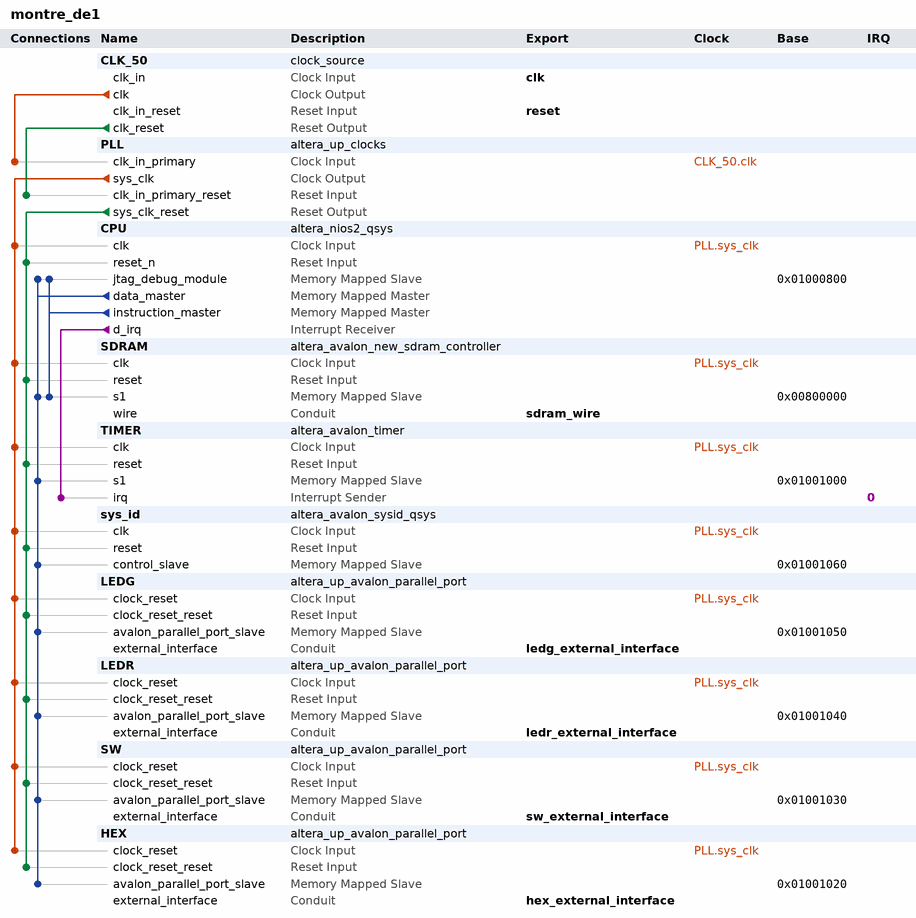
[diagram p0: system contents]
# Platform Designer (Qsys) system montre_de1, Cyclone II EP2C20F484C7
# Parameters at their usual value, and those the tool derives, are not listed.
package require -exact qsys 13.0
create_system montre_de1
set_project_property DEVICE_FAMILY {Cyclone II}
set_project_property DEVICE EP2C20F484C7

add_instance CLK_50 clock_source 13.0
set_instance_parameter_value CLK_50 clockFrequency 50000000

add_instance PLL altera_up_clocks 13.0
set_instance_parameter_value PLL board DE1
set_instance_parameter_value PLL vga_clk false
set_instance_parameter_value PLL audio_clk false
set_instance_parameter_value PLL audio_clk_freq 12.288

add_instance CPU altera_nios2_qsys 13.0
set_instance_parameter_value CPU resetSlave SDRAM.s1
set_instance_parameter_value CPU mmu_TLBMissExcSlave None
set_instance_parameter_value CPU exceptionSlave SDRAM.s1
set_instance_parameter_value CPU breakSlave CPU.jtag_debug_module
set_instance_parameter_value CPU impl Tiny
set_instance_parameter_value CPU icache_size 4096

add_instance SDRAM altera_avalon_new_sdram_controller 13.0.1.99.2
set_instance_parameter_value SDRAM TAC 5.5
set_instance_parameter_value SDRAM TRCD 20.0
set_instance_parameter_value SDRAM TRP 20.0
set_instance_parameter_value SDRAM casLatency 3
set_instance_parameter_value SDRAM columnWidth 8
set_instance_parameter_value SDRAM dataWidth 16
set_instance_parameter_value SDRAM generateSimulationModel false
set_instance_parameter_value SDRAM model single_Micron_MT48LC4M32B2_7_chip
set_instance_parameter_value SDRAM numberOfBanks 4
set_instance_parameter_value SDRAM numberOfChipSelects 1
set_instance_parameter_value SDRAM powerUpDelay 100.0
set_instance_parameter_value SDRAM refreshPeriod 15.625
set_instance_parameter_value SDRAM rowWidth 12

add_instance TIMER altera_avalon_timer 13.0.1.99.2
set_instance_parameter_value TIMER period 1
set_instance_parameter_value TIMER periodUnits SEC

add_instance sys_id altera_avalon_sysid_qsys 13.0
set_instance_parameter_value sys_id id 0

add_instance LEDG altera_up_avalon_parallel_port 13.0
set_instance_parameter_value LEDG board DE1
set_instance_parameter_value LEDG preset LEDs
set_instance_parameter_value LEDG capture false
set_instance_parameter_value LEDG edge Rising
set_instance_parameter_value LEDG irq false

add_instance LEDR altera_up_avalon_parallel_port 13.0
set_instance_parameter_value LEDR board DE1
set_instance_parameter_value LEDR preset LEDs
set_instance_parameter_value LEDR leds Red
set_instance_parameter_value LEDR capture false
set_instance_parameter_value LEDR edge Rising
set_instance_parameter_value LEDR irq false

add_instance SW altera_up_avalon_parallel_port 13.0
set_instance_parameter_value SW board DE1
set_instance_parameter_value SW preset {Slider Switches}
set_instance_parameter_value SW capture false
set_instance_parameter_value SW edge Rising
set_instance_parameter_value SW irq false

add_instance HEX altera_up_avalon_parallel_port 13.0
set_instance_parameter_value HEX board DE1
set_instance_parameter_value HEX preset {Seven Segment Displays}
set_instance_parameter_value HEX capture false
set_instance_parameter_value HEX edge Rising
set_instance_parameter_value HEX irq false

# connections
add_connection CLK_50.clk PLL.clk_in_primary clock
add_connection PLL.sys_clk CPU.clk clock
add_connection PLL.sys_clk HEX.clock_reset clock
add_connection PLL.sys_clk LEDG.clock_reset clock
add_connection PLL.sys_clk LEDR.clock_reset clock
add_connection PLL.sys_clk SDRAM.clk clock
add_connection PLL.sys_clk SW.clock_reset clock
add_connection PLL.sys_clk sys_id.clk clock
add_connection PLL.sys_clk TIMER.clk clock
add_connection CLK_50.clk_reset PLL.clk_in_primary_reset reset
add_connection PLL.sys_clk_reset CPU.reset_n reset
add_connection PLL.sys_clk_reset HEX.clock_reset_reset reset
add_connection PLL.sys_clk_reset LEDG.clock_reset_reset reset
add_connection PLL.sys_clk_reset LEDR.clock_reset_reset reset
add_connection PLL.sys_clk_reset SDRAM.reset reset
add_connection PLL.sys_clk_reset SW.clock_reset_reset reset
add_connection PLL.sys_clk_reset sys_id.reset reset
add_connection PLL.sys_clk_reset TIMER.reset reset
add_connection CPU.data_master CPU.jtag_debug_module avalon
set_connection_parameter_value CPU.data_master/CPU.jtag_debug_module baseAddress 0x01000800
add_connection CPU.data_master HEX.avalon_parallel_port_slave avalon
set_connection_parameter_value CPU.data_master/HEX.avalon_parallel_port_slave baseAddress 0x01001020
add_connection CPU.data_master LEDG.avalon_parallel_port_slave avalon
set_connection_parameter_value CPU.data_master/LEDG.avalon_parallel_port_slave baseAddress 0x01001050
add_connection CPU.data_master LEDR.avalon_parallel_port_slave avalon
set_connection_parameter_value CPU.data_master/LEDR.avalon_parallel_port_slave baseAddress 0x01001040
add_connection CPU.data_master SDRAM.s1 avalon
set_connection_parameter_value CPU.data_master/SDRAM.s1 baseAddress 0x00800000
add_connection CPU.data_master SW.avalon_parallel_port_slave avalon
set_connection_parameter_value CPU.data_master/SW.avalon_parallel_port_slave baseAddress 0x01001030
add_connection CPU.data_master sys_id.control_slave avalon
set_connection_parameter_value CPU.data_master/sys_id.control_slave baseAddress 0x01001060
add_connection CPU.data_master TIMER.s1 avalon
set_connection_parameter_value CPU.data_master/TIMER.s1 baseAddress 0x01001000
add_connection CPU.instruction_master CPU.jtag_debug_module avalon
set_connection_parameter_value CPU.instruction_master/CPU.jtag_debug_module baseAddress 0x01000800
add_connection CPU.instruction_master SDRAM.s1 avalon
set_connection_parameter_value CPU.instruction_master/SDRAM.s1 baseAddress 0x00800000
add_connection CPU.d_irq TIMER.irq interrupt
set_connection_parameter_value CPU.d_irq/TIMER.irq irqNumber 0

# exported interfaces
add_interface clk clock sink
set_interface_property clk EXPORT_OF CLK_50.clk_in
add_interface reset reset sink
set_interface_property reset EXPORT_OF CLK_50.clk_in_reset
add_interface sdram_wire conduit end
set_interface_property sdram_wire EXPORT_OF SDRAM.wire
add_interface sw_external_interface conduit end
set_interface_property sw_external_interface EXPORT_OF SW.external_interface
add_interface ledr_external_interface conduit end
set_interface_property ledr_external_interface EXPORT_OF LEDR.external_interface
add_interface ledg_external_interface conduit end
set_interface_property ledg_external_interface EXPORT_OF LEDG.external_interface
add_interface hex_external_interface conduit end
set_interface_property hex_external_interface EXPORT_OF HEX.external_interface

set_interconnect_requirement {$system} qsys_mm.clockCrossingAdapter HANDSHAKE
set_interconnect_requirement {$system} qsys_mm.maxAdditionalLatency 1

save_system montre_de1.qsys
